# Altium project pca20035.PrjPCB (part 4 of 4)
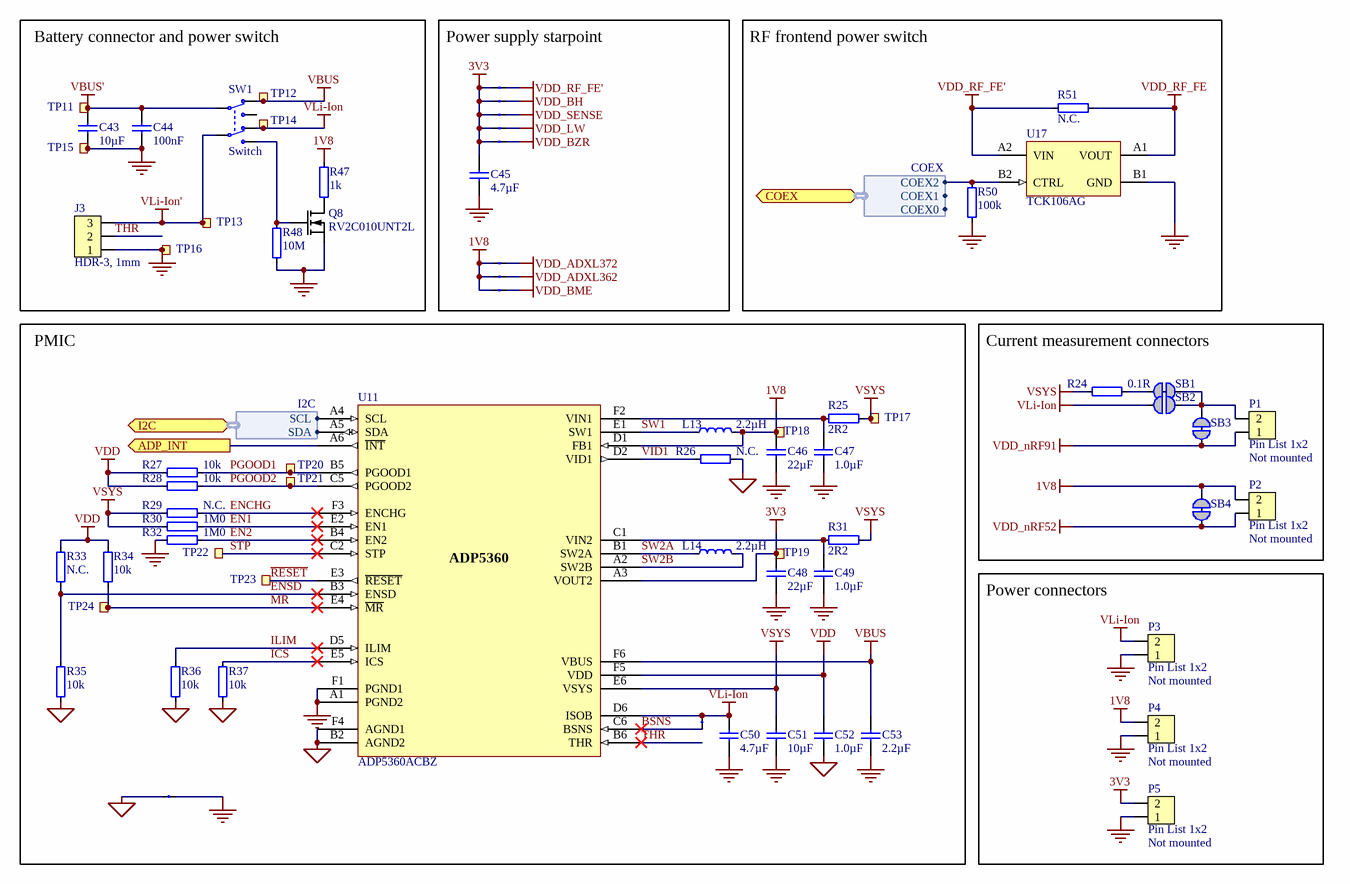
[diagram p6: pca20035_sheet5_power_supply.SchDoc]

## Nets that join several sheets
1V8: pca20035_sheet2_nrf91_mcu (5 pins), pca20035_sheet4_sensors_and_leds (C7.1 R22.1 R23.1 U13.4), pca20035_sheet6_interface (7 pins), pca20035_sheet5_power_supply (11 pins)
GND: pca20035_sheet2_nrf91_mcu (73 pins), pca20035_sheet4_sensors_and_leds (35 pins), pca20035_sheet3_nrf52_mcu (50 pins), pca20035_sheet6_interface (26 pins), pca20035_sheet5_power_supply (24 pins)
VBUS: pca20035_sheet3_nrf52_mcu (C33.1 U6.J9), pca20035_sheet5_power_supply (C53.2 SW1.3 TP12.1 U11.F6)
VBUS': pca20035_sheet6_interface (J6.1), pca20035_sheet5_power_supply (C43.1 C44.1 SW1.2 TP11.1)
VDD_ADXL362: pca20035_sheet4_sensors_and_leds (C38.2 C39.2 U8.1 U8.14), pca20035_sheet5_power_supply (ST8.2)
VDD_ADXL372: pca20035_sheet4_sensors_and_leds (C36.2 C37.2 U7.1 U7.14), pca20035_sheet5_power_supply (ST7.2)
VDD_BH: pca20035_sheet4_sensors_and_leds (C42.2 U10.2), pca20035_sheet5_power_supply (ST2.2)
VDD_BME: pca20035_sheet4_sensors_and_leds (5 pins), pca20035_sheet5_power_supply (ST9.2)
VDD_BZR: pca20035_sheet4_sensors_and_leds (Bz1.1 D2.1), pca20035_sheet5_power_supply (ST5.2)
VDD_LW: pca20035_sheet4_sensors_and_leds (6 pins), pca20035_sheet5_power_supply (ST4.2)
VDD_nRF52: pca20035_sheet3_nrf52_mcu (11 pins), pca20035_sheet5_power_supply (P2.1 SB4.1)
VDD_nRF91: pca20035_sheet2_nrf91_mcu (8 pins), pca20035_sheet5_power_supply (P1.1 SB3.1)
VDD_RF_FE: pca20035_sheet2_nrf91_mcu (8 pins), pca20035_sheet5_power_supply (R51.1 U17.A1)
VDD_SENSE: pca20035_sheet4_sensors_and_leds (LD1.4), pca20035_sheet5_power_supply (ST3.2)
COEX0: pca20035_sheet2_nrf91_mcu (SB12.1 TP39.1 U1.93), pca20035_sheet3_nrf52_mcu (U6.G1)
D_N: pca20035_sheet3_nrf52_mcu (U6.J8), pca20035_sheet6_interface (J6.2 TP30.1)
D_P: pca20035_sheet3_nrf52_mcu (U6.K8), pca20035_sheet6_interface (J6.3 TP31.1)
NetSB5_2: pca20035_sheet2_nrf91_mcu (SB5.2), pca20035_sheet4_sensors_and_leds (U7.9)
NetSB6_2: pca20035_sheet2_nrf91_mcu (SB6.2), pca20035_sheet4_sensors_and_leds (U8.9)
nRF52_P0.03: pca20035_sheet3_nrf52_mcu (U6.A5), pca20035_sheet6_interface (TP25.1)
nRF52_P0.05: pca20035_sheet3_nrf52_mcu (U6.D10), pca20035_sheet6_interface (P6.2)
nRF52_P0.06: pca20035_sheet3_nrf52_mcu (U6.E9), pca20035_sheet6_interface (P6.1)
nRF52_P0.09: pca20035_sheet3_nrf52_mcu (U6.F1), pca20035_sheet6_interface (C57.2 J5.4)
nRF52_P0.10: pca20035_sheet3_nrf52_mcu (U6.E2), pca20035_sheet6_interface (C56.1 J5.2)
nRF52_P0.11: pca20035_sheet2_nrf91_mcu (U1.29), pca20035_sheet3_nrf52_mcu (U6.H8)
nRF52_P0.14: pca20035_sheet3_nrf52_mcu (U6.J7), pca20035_sheet6_interface (U12.8)
nRF52_P0.15: pca20035_sheet2_nrf91_mcu (U1.30), pca20035_sheet3_nrf52_mcu (U6.K7)
nRF52_P0.17: pca20035_sheet3_nrf52_mcu (U6.J6), pca20035_sheet6_interface (R40.1 U12.10)
nRF52_P0.19: pca20035_sheet2_nrf91_mcu (SB10.1), pca20035_sheet3_nrf52_mcu (U6.K4)
nRF52_P0.20: pca20035_sheet2_nrf91_mcu (U1.35), pca20035_sheet3_nrf52_mcu (U6.J5)
nRF52_P0.21: pca20035_sheet2_nrf91_mcu (SB7.1), pca20035_sheet3_nrf52_mcu (U6.J4)
nRF52_P0.22: pca20035_sheet2_nrf91_mcu (SB11.1), pca20035_sheet3_nrf52_mcu (U6.K3)
nRF52_P0.25: pca20035_sheet2_nrf91_mcu (SB9.1), pca20035_sheet3_nrf52_mcu (U6.K2)
nRF52_P0.26: pca20035_sheet3_nrf52_mcu (U6.C9), pca20035_sheet6_interface (P6.3)
nRF52_P0.27: pca20035_sheet3_nrf52_mcu (U6.D9), pca20035_sheet6_interface (P6.4)
nRF52_P0.28: pca20035_sheet3_nrf52_mcu (U6.A6), pca20035_sheet6_interface (P6.5)
nRF52_P0.30: pca20035_sheet3_nrf52_mcu (U6.A7), pca20035_sheet6_interface (P6.6)
nRF52_P1.00: pca20035_sheet2_nrf91_mcu (SB8.1), pca20035_sheet3_nrf52_mcu (U6.J3)
nRF52_P1.01: pca20035_sheet2_nrf91_mcu (TP41.1 U1.91), pca20035_sheet3_nrf52_mcu (U6.J1), pca20035_sheet5_power_supply (R50.2 U17.B2)
nRF52_P1.04: pca20035_sheet2_nrf91_mcu (TP40.1 U1.92), pca20035_sheet3_nrf52_mcu (U6.H1)
nRF52_P1.05: pca20035_sheet3_nrf52_mcu (U6.G2), pca20035_sheet6_interface (U12.12)
nRF52_P1.08: pca20035_sheet2_nrf91_mcu (U1.19), pca20035_sheet4_sensors_and_leds (5 pins), pca20035_sheet3_nrf52_mcu (U6.G9), pca20035_sheet5_power_supply (U11.A5)
nRF52_P1.09: pca20035_sheet2_nrf91_mcu (U1.20), pca20035_sheet4_sensors_and_leds (5 pins), pca20035_sheet3_nrf52_mcu (U6.F10), pca20035_sheet5_power_supply (U11.A4)
nRF52_P1.11: pca20035_sheet3_nrf52_mcu (U6.A3), pca20035_sheet6_interface (TP26.1)
nRF52_P1.13: pca20035_sheet3_nrf52_mcu (U6.A4), pca20035_sheet6_interface (SW4.2)
nRF52_RST: pca20035_sheet2_nrf91_mcu (SB14.2), pca20035_sheet3_nrf52_mcu (TP8.1 U6.K6), pca20035_sheet6_interface (U14.6)
nRF52_SWDCLK: pca20035_sheet3_nrf52_mcu (U6.H2), pca20035_sheet6_interface (U12.3)
nRF52_SWDIO: pca20035_sheet3_nrf52_mcu (U6.J2), pca20035_sheet6_interface (U12.15)
nRF91_RST: pca20035_sheet2_nrf91_mcu (R8.1), pca20035_sheet6_interface (U14.4)
nRF91_SWDCLK: pca20035_sheet2_nrf91_mcu (U1.33), pca20035_sheet6_interface (U12.5 U12.11)
nRF91_SWDIO: pca20035_sheet2_nrf91_mcu (U1.34), pca20035_sheet6_interface (U12.1 U12.7)
P0.00: pca20035_sheet2_nrf91_mcu (U1.95), pca20035_sheet4_sensors_and_leds (Q3.2 R44.2)
P0.01: pca20035_sheet2_nrf91_mcu (U1.96), pca20035_sheet4_sensors_and_leds (Q4.2 R45.2)
P0.02: pca20035_sheet2_nrf91_mcu (U1.97), pca20035_sheet4_sensors_and_leds (Q4.5 R46.2)
P0.03: pca20035_sheet2_nrf91_mcu (TP34.1 U1.99), pca20035_sheet4_sensors_and_leds (U7.4 U8.4)
P0.04: pca20035_sheet2_nrf91_mcu (TP35.1 U1.100), pca20035_sheet4_sensors_and_leds (U7.6 U8.6)
P0.05: pca20035_sheet2_nrf91_mcu (TP36.1 U1.2), pca20035_sheet4_sensors_and_leds (U7.7 U8.7)
P0.06: pca20035_sheet2_nrf91_mcu (U1.3), pca20035_sheet4_sensors_and_leds (U7.11)
P0.07: pca20035_sheet2_nrf91_mcu (TP37.1 U1.4), pca20035_sheet4_sensors_and_leds (U7.8)
P0.08: pca20035_sheet2_nrf91_mcu (TP38.1 U1.15), pca20035_sheet4_sensors_and_leds (U8.8)
P0.09: pca20035_sheet2_nrf91_mcu (U1.16), pca20035_sheet4_sensors_and_leds (U8.11)
P0.13/AIN0: pca20035_sheet2_nrf91_mcu (TP32.1 U1.23), pca20035_sheet6_interface (Q6.2)
P0.14/AIN1: pca20035_sheet2_nrf91_mcu (U1.24), pca20035_sheet6_interface (Q6.5)
P0.15/AIN2: pca20035_sheet2_nrf91_mcu (U1.25), pca20035_sheet6_interface (Q7.2)
P0.16/AIN3: pca20035_sheet2_nrf91_mcu (TP33.1 U1.26), pca20035_sheet6_interface (Q7.5)
P0.17/AIN4: pca20035_sheet2_nrf91_mcu (U1.28), pca20035_sheet5_power_supply (U11.A6)
P0.26: pca20035_sheet2_nrf91_mcu (U1.83), pca20035_sheet6_interface (SW3.2)
P0.27: pca20035_sheet2_nrf91_mcu (U1.84), pca20035_sheet4_sensors_and_leds (U10.7)
P0.28: pca20035_sheet2_nrf91_mcu (U1.86), pca20035_sheet4_sensors_and_leds (R21.2)
P0.29: pca20035_sheet2_nrf91_mcu (U1.87), pca20035_sheet4_sensors_and_leds (Q2.5 R41.2)
P0.30: pca20035_sheet2_nrf91_mcu (U1.88), pca20035_sheet4_sensors_and_leds (Q2.2 R42.2)
P0.31: pca20035_sheet2_nrf91_mcu (U1.89), pca20035_sheet4_sensors_and_leds (Q3.5 R43.2)
SIM_1V8: pca20035_sheet2_nrf91_mcu (U1.49), pca20035_sheet6_interface (C34.2 R49.2 U16.14 U16.16)
SIM_CLK: pca20035_sheet2_nrf91_mcu (U1.46), pca20035_sheet6_interface (U16.8)
SIM_DET: pca20035_sheet2_nrf91_mcu (U1.45), pca20035_sheet6_interface (R52.2)
SIM_IO: pca20035_sheet2_nrf91_mcu (U1.48), pca20035_sheet6_interface (U16.12)
SIM_RST: pca20035_sheet2_nrf91_mcu (U1.43), pca20035_sheet6_interface (U16.4)